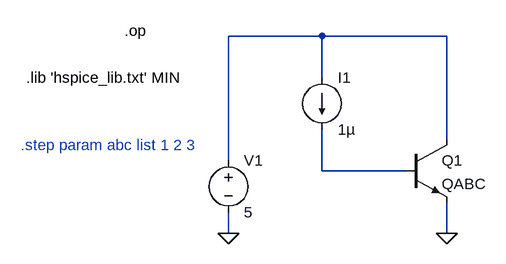
[diagram p0: schematic hspice_lib_test1.asc]
hspice_lib_test1.asc, the LTspice schematic file:
Version 4
SHEET 1 880 1076
WIRE -32 48 -176 48
WIRE 160 48 -32 48
WIRE -32 112 -32 48
WIRE 160 208 160 48
WIRE -176 240 -176 48
WIRE -32 256 -32 192
WIRE 96 256 -32 256
WIRE -176 352 -176 320
WIRE 160 352 160 304
FLAG 160 352 0
FLAG -176 352 0
SYMBOL npn 96 208 R0
SYMATTR InstName Q1
SYMATTR Value QABC
SYMBOL current -32 112 R0
SYMATTR InstName I1
SYMATTR Value 1µ
SYMBOL voltage -176 224 R0
SYMATTR InstName V1
SYMATTR Value 5
TEXT -336 40 Left 0 !.op
TEXT -488 112 Left 0 !.lib 'hspice_lib.txt' MIN
TEXT -496 216 Left 0 ;.step param abc list 1 2 3

The netlist it stands for:
* hspice_lib_test1.asc
Q1 N001 N002 0 0 QABC
I1 N001 N002 1µ
V1 N001 0 5
.model NPN NPN
.model PNP PNP
.lib standard.bjt
.op
.lib 'hspice_lib.txt' MIN
* .step param abc list 1 2 3
.backanno
.end